# Altium schematic sheet УПРАВЛ.SchDoc
size A3; Organization: Altium Limited; Address1: L3, 12a Rodborough Rd; Address2: Frenchs Forest; Address3: NSW; Address4: Australia 2086
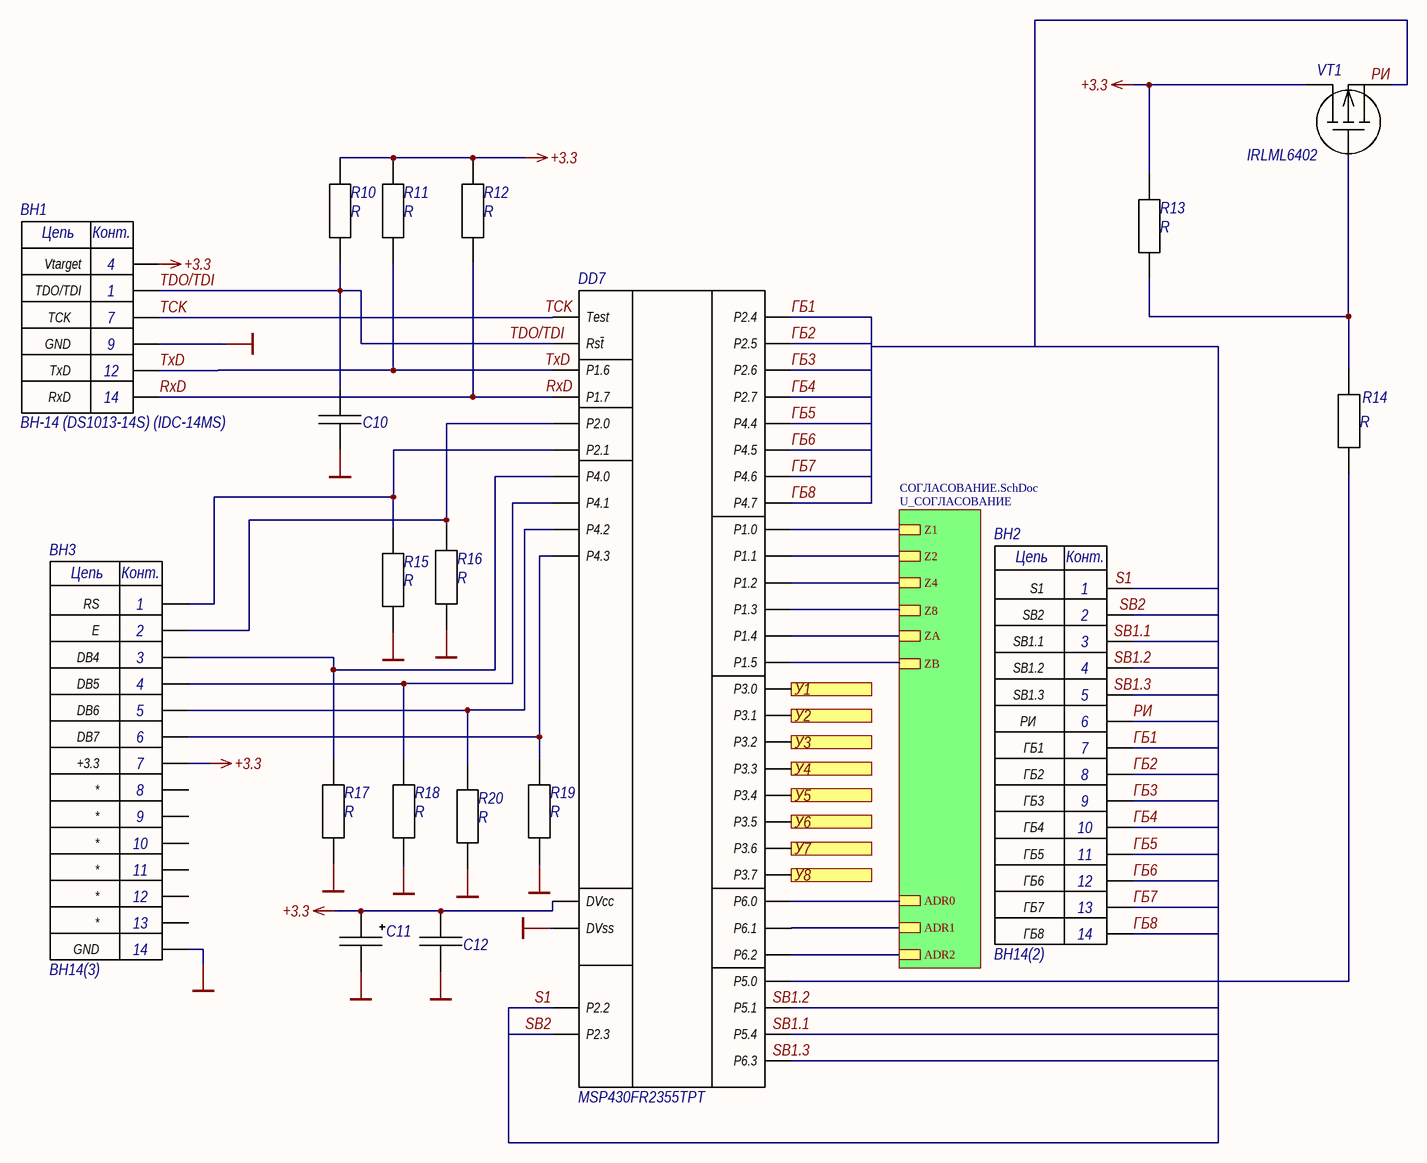
[diagram p0: УПРАВЛ.SchDoc]

## Parts
BH1  BH-14 (DS1013-14S) (IDC-14MS)  [BH-14 (DS1013-14S) (IDC-14MS)]
BH2  BH14(2)  [BH-14 (DS1013-14S) (IDC-14MS)]
BH3  BH14(3)  [BH-14 (DS1013-14S) (IDC-14MS)]
C10  C(ceramic)  [C(ceramic)]  (value not drawn)
C11  C(AlEL)  [C(AlEL)]  (value not drawn)
C12  C(ceramic)  [C(ceramic)]  (value not drawn)
DD7  MSP430FR2355TPT  [MSP430FR2355TPT]
R10  R  [R]
R11  R  [R]
R12  R  [R]
R13  R  [R]
R14  R  [R]
R15  R  [R]
R16  R  [R]
R17  R  [R]
R18  R  [R]
R19  R  [R]
R20  R  [R]
VT1  IRLML6402  [BC847(IRLML6402)]

## Sub-sheets
U_СОГЛАСОВАНИЕ = СОГЛАСОВАНИЕ.SchDoc: ZA, ZB, ADR0, ADR1, ADR2, Z1, Z4, Z8, Z2

## Ports
У1, У2, У3, У4, У5, У6, У7, У8

## Nets
+3.3: BH1.4(Vtarget) BH3.7(+3.3) C11.1 C12.2 DD7.6(DVcc) R10.2 R11.2 R12.2 R13.2 VT1.3
GND: BH1.9(GND) BH3.14(GND) C10.1 C11.2 C12.1 DD7.7(DVss) R15.1 R16.1 R17.1 R18.1 R19.1 R20.1
RxD: BH1.14(RxD) DD7.31(P1.7) R12.1
S1: BH2.1(S1) DD7.28(P2.2)
SB1.1: BH2.3(SB1.1) DD7.39(P5.4)
SB1.2: BH2.4(SB1.2) DD7.42(P5.1)
SB1.3: BH2.5(SB1.3) DD7.19(P6.3)
SB2: BH2.2(SB2) DD7.27(P2.3)
TCK: BH1.7(TCK) DD7.4(Test)
TDO/TDI: BH1.1(TDO/TDI) C10.2 DD7.5(Rs~{t}) R10.1
TxD: BH1.12(TxD) DD7.32(P1.6) R11.1
ГБ1: BH2.7(ГБ1) DD7.11(P2.4)
ГБ2: BH2.8(ГБ2) DD7.10(P2.5)
ГБ3: BH2.9(ГБ3) DD7.9(P2.6)
ГБ4: BH2.10(ГБ4) DD7.8(P2.7)
ГБ5: BH2.11(ГБ5) DD7.15(P4.4)
ГБ6: BH2.12(ГБ6) DD7.14(P4.5)
ГБ7: BH2.13(ГБ7) DD7.13(P4.6)
ГБ8: BH2.14(ГБ8) DD7.12(P4.7)
РИ: BH2.6(РИ) VT1.2
У1: DD7.47(P3.0) ; port У1
У2: DD7.46(P3.1) ; port У2
У3: DD7.45(P3.2) ; port У3
У4: DD7.44(P3.3) ; port У4
У5: DD7.38(P3.4) ; port У5
У6: DD7.37(P3.5) ; port У6
У7: DD7.36(P3.6) ; port У7
У8: DD7.35(P3.7) ; port У8
NetBH3_1: BH3.1(RS) DD7.29(P2.1) R15.2
NetBH3_2: BH3.2(E) DD7.30(P2.0) R16.2
NetBH3_3: BH3.3(DB4) DD7.26(P4.0) R17.2
NetBH3_4: BH3.4(DB5) DD7.25(P4.1) R18.2
NetBH3_5: BH3.5(DB6) DD7.24(P4.2) R20.2
NetBH3_6: BH3.6(DB7) DD7.23(P4.3) R19.2
NetDD7_1: DD7.1(P1.2) ; sheet U_СОГЛАСОВАНИЕ/Z4
NetDD7_2: DD7.2(P1.1) ; sheet U_СОГЛАСОВАНИЕ/Z2
NetDD7_3: DD7.3(P1.0) ; sheet U_СОГЛАСОВАНИЕ/Z1
NetDD7_20: DD7.20(P6.2) ; sheet U_СОГЛАСОВАНИЕ/ADR2
NetDD7_21: DD7.21(P6.1) ; sheet U_СОГЛАСОВАНИЕ/ADR1
NetDD7_22: DD7.22(P6.0) ; sheet U_СОГЛАСОВАНИЕ/ADR0
NetDD7_33: DD7.33(P1.5) ; sheet U_СОГЛАСОВАНИЕ/ZB
NetDD7_34: DD7.34(P1.4) ; sheet U_СОГЛАСОВАНИЕ/ZA
NetDD7_43: DD7.43(P5.0) R14.1
NetDD7_48: DD7.48(P1.3) ; sheet U_СОГЛАСОВАНИЕ/Z8
NetR13_1: R13.1 R14.2 VT1.1

Not connected (* = marked no-connect by the designer): BH3 8(*) 9(*) 10(*) 11(*) 12(*) 13(*)

## Notes on the sheet
- Title
- Size:
- Date:
- A3
- Number:
- Time:
- Revision:
- Sheet
- of
- File:
- (in symbol BH14(2)) Цепь; Конт.
- (in symbol BH14(3)) Цепь; Конт.
- (in symbol BH-14 (DS1013-14S) (IDC-14MS)) Цепь; Конт.